# Altium schematic sheet FCT_connector.SchDoc
size A2; DocumentNumber: 5; SheetNumber: 5; SheetTotal: 6
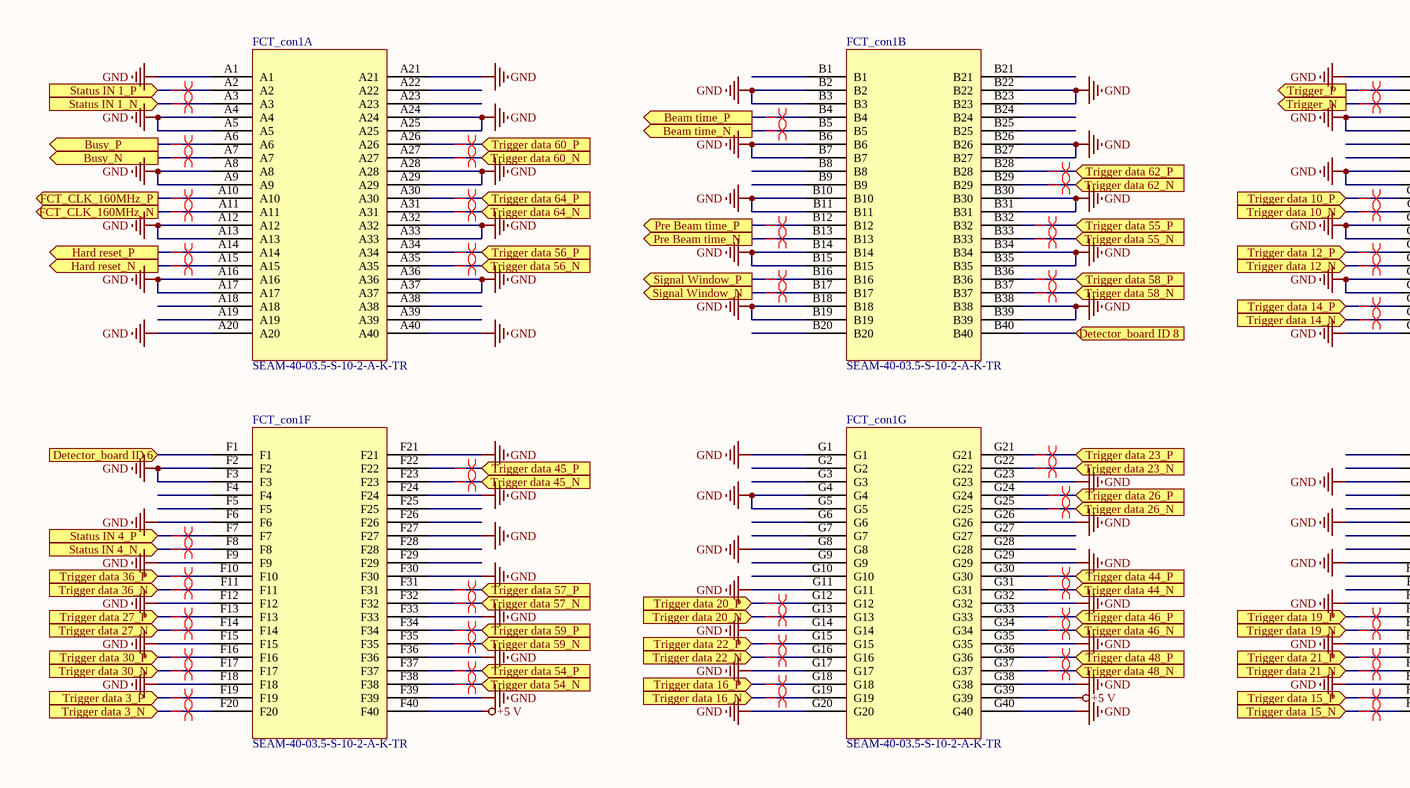
[diagram p0: FCT_connector.SchDoc, left]
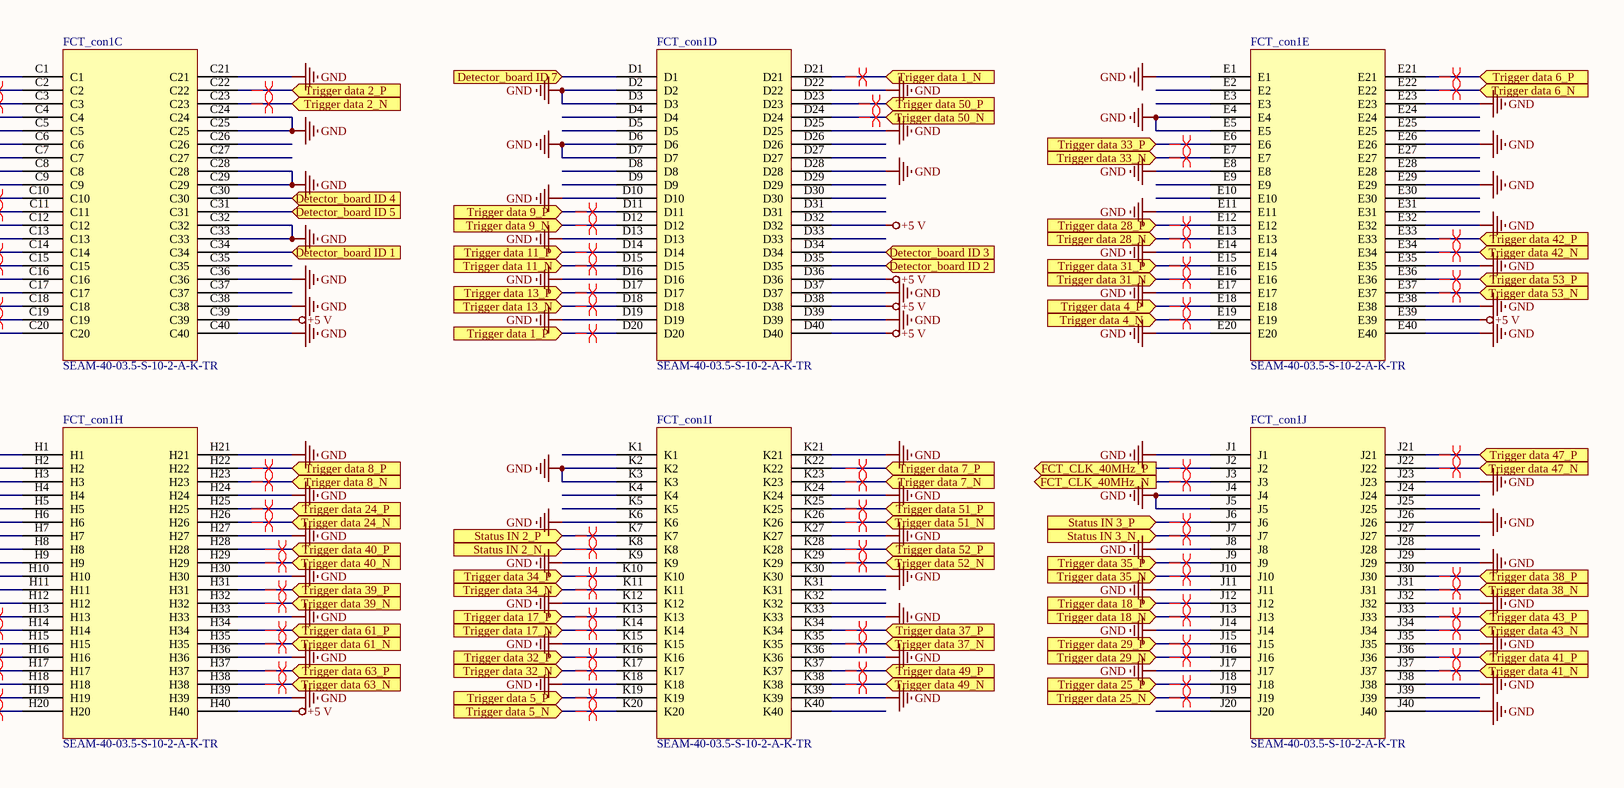
[diagram p1: FCT_connector.SchDoc, right]

## Parts
FCT_con1  SEAM-40-03.5-S-10-2-A-K-TR  [SEAM-40-03.5-S-10-2-A-K-TR]  (parts A,B,C,D,E,F,G,H,I,J of 10)

## Ports
Beam time_N (out), Beam time_P (out), Busy_N (out), Busy_P (out), Detector_board ID 1 (in), Detector_board ID 2 (in), Detector_board ID 3 (in), Detector_board ID 4 (in), Detector_board ID 5 (in), Detector_board ID 6 (in), Detector_board ID 7 (in), Detector_board ID 8 (in), FCT_CLK_40MHz_N (out), FCT_CLK_40MHz_P (out), FCT_CLK_160MHz_N (out), FCT_CLK_160MHz_P (out), Hard reset_N (out), Hard reset_P (out), Pre Beam time_N (out), Pre Beam time_P (out), Signal Window_N (out), Signal Window_P (out), Status IN 1_N (in), Status IN 1_P (in), Status IN 2_N (in), Status IN 2_P (in), Status IN 3_N (in), Status IN 3_P (in), Status IN 4_N (in), Status IN 4_P (in), Trigger data 1_N (in), Trigger data 1_P (in), Trigger data 2_N (in), Trigger data 2_P (in), Trigger data 3_N (in), Trigger data 3_P (in), Trigger data 4_N (in), Trigger data 4_P (in), Trigger data 5_N (in), Trigger data 5_P (in), Trigger data 6_N (in), Trigger data 6_P (in), Trigger data 7_N (in), Trigger data 7_P (in), Trigger data 8_N (in), Trigger data 8_P (in), Trigger data 9_N (in), Trigger data 9_P (in), Trigger data 10_N (in), Trigger data 10_P (in), Trigger data 11_N (in), Trigger data 11_P (in), Trigger data 12_N (in), Trigger data 12_P (in), Trigger data 13_N (in), Trigger data 13_P (in), Trigger data 14_N (in), Trigger data 14_P (in), Trigger data 15_N (in), Trigger data 15_P (in), Trigger data 16_N (in), Trigger data 16_P (in), Trigger data 17_N (in), Trigger data 17_P (in), Trigger data 18_N (in), Trigger data 18_P (in), Trigger data 19_N (in), Trigger data 19_P (in), Trigger data 20_N (in), Trigger data 20_P (in), Trigger data 21_N (in), Trigger data 21_P (in), Trigger data 22_N (in), Trigger data 22_P (in), Trigger data 23_N (in), Trigger data 23_P (in), Trigger data 24_N (in), Trigger data 24_P (in), Trigger data 25_N (in), Trigger data 25_P (in), Trigger data 26_N (in), Trigger data 26_P (in), Trigger data 27_N (in), Trigger data 27_P (in), Trigger data 28_N (in), Trigger data 28_P (in), Trigger data 29_N (in), Trigger data 29_P (in), Trigger data 30_N (in), Trigger data 30_P (in), Trigger data 31_N (in), Trigger data 31_P (in), Trigger data 32_N (in), Trigger data 32_P (in), Trigger data 33_N (in), Trigger data 33_P (in), Trigger data 34_N (in), Trigger data 34_P (in), Trigger data 35_N (in), Trigger data 35_P (in), Trigger data 36_N (in), Trigger data 36_P (in), Trigger data 37_N (in), Trigger data 37_P (in), Trigger data 38_N (in), Trigger data 38_P (in), Trigger data 39_N (in), Trigger data 39_P (in), Trigger data 40_N (in), Trigger data 40_P (in), Trigger data 41_N (in), Trigger data 41_P (in), Trigger data 42_N (in), Trigger data 42_P (in), Trigger data 43_N (in), Trigger data 43_P (in), Trigger data 44_N (in), Trigger data 44_P (in), Trigger data 45_N (in), Trigger data 45_P (in), Trigger data 46_N (in), Trigger data 46_P (in), Trigger data 47_N (in), Trigger data 47_P (in), Trigger data 48_N (in), Trigger data 48_P (in), Trigger data 49_N (in), Trigger data 49_P (in), Trigger data 50_N (in), Trigger data 50_P (in), Trigger data 51_N (in), Trigger data 51_P (in), Trigger data 52_N (in), Trigger data 52_P (in), Trigger data 53_N (in), Trigger data 53_P (in), Trigger data 54_N (in), Trigger data 54_P (in), Trigger data 55_N (in), Trigger data 55_P (in), Trigger data 56_N (in), Trigger data 56_P (in), Trigger data 57_N (in), Trigger data 57_P (in), Trigger data 58_N (in), Trigger data 58_P (in), Trigger data 59_N (in), Trigger data 59_P (in), Trigger data 60_N (in), Trigger data 60_P (in), Trigger data 61_N (in), Trigger data 61_P (in), Trigger data 62_N (in), Trigger data 62_P (in), Trigger data 63_N (in), Trigger data 63_P (in), Trigger data 64_N (in), Trigger data 64_P (in), Trigger_N (out), Trigger_P (out)

## Nets
+5 V: FCT_con1.C39 FCT_con1.D32 FCT_con1.D36 FCT_con1.D38 FCT_con1.D40 FCT_con1.E39 FCT_con1.F40 FCT_con1.G39 FCT_con1.H40
GND: FCT_con1.A1 FCT_con1.A4 FCT_con1.A5 FCT_con1.A8 FCT_con1.A9 FCT_con1.A12 FCT_con1.A13 FCT_con1.A16 FCT_con1.A17 FCT_con1.A20 FCT_con1.A21 FCT_con1.A24 FCT_con1.A25 FCT_con1.A28 FCT_con1.A29 FCT_con1.A32 FCT_con1.A33 FCT_con1.A36 FCT_con1.A37 FCT_con1.A40 FCT_con1.B2 FCT_con1.B3 FCT_con1.B6 FCT_con1.B7 FCT_con1.B10 FCT_con1.B11 FCT_con1.B14 FCT_con1.B15 FCT_con1.B18 FCT_con1.B19 FCT_con1.B22 FCT_con1.B23 FCT_con1.B26 FCT_con1.B27 FCT_con1.B30 FCT_con1.B31 FCT_con1.B34 FCT_con1.B35 FCT_con1.B38 FCT_con1.B39 FCT_con1.C1 FCT_con1.C4 FCT_con1.C5 FCT_con1.C8 FCT_con1.C9 FCT_con1.C12 FCT_con1.C13 FCT_con1.C16 FCT_con1.C17 FCT_con1.C20 FCT_con1.C21 FCT_con1.C24 FCT_con1.C25 FCT_con1.C28 FCT_con1.C29 FCT_con1.C32 FCT_con1.C33 FCT_con1.C36 FCT_con1.C38 FCT_con1.C40 FCT_con1.D2 FCT_con1.D3 FCT_con1.D6 FCT_con1.D7 FCT_con1.D10 FCT_con1.D13 FCT_con1.D16 FCT_con1.D19 FCT_con1.D22 FCT_con1.D25 FCT_con1.D28 FCT_con1.D37 FCT_con1.D39 FCT_con1.E1 FCT_con1.E4 FCT_con1.E5 FCT_con1.E8 FCT_con1.E11 FCT_con1.E14 FCT_con1.E17 FCT_con1.E20 FCT_con1.E23 FCT_con1.E26 FCT_con1.E29 FCT_con1.E32 FCT_con1.E35 FCT_con1.E38 FCT_con1.E40 FCT_con1.F2 FCT_con1.F3 FCT_con1.F6 FCT_con1.F9 FCT_con1.F12 FCT_con1.F15 FCT_con1.F18 FCT_con1.F21 FCT_con1.F24 FCT_con1.F27 FCT_con1.F30 FCT_con1.F33 FCT_con1.F36 FCT_con1.F39 FCT_con1.G1 FCT_con1.G4 FCT_con1.G5 FCT_con1.G8 FCT_con1.G11 FCT_con1.G14 FCT_con1.G17 FCT_con1.G20 FCT_con1.G23 FCT_con1.G26 FCT_con1.G29 FCT_con1.G32 FCT_con1.G35 FCT_con1.G38 FCT_con1.G40 FCT_con1.H3 FCT_con1.H6 FCT_con1.H9 FCT_con1.H12 FCT_con1.H15 FCT_con1.H18 FCT_con1.H21 FCT_con1.H24 FCT_con1.H27 FCT_con1.H30 FCT_con1.H33 FCT_con1.H36 FCT_con1.H39 FCT_con1.J1 FCT_con1.J4 FCT_con1.J5 FCT_con1.J8 FCT_con1.J11 FCT_con1.J14 FCT_con1.J17 FCT_con1.J23 FCT_con1.J26 FCT_con1.J29 FCT_con1.J32 FCT_con1.J35 FCT_con1.J38 FCT_con1.J40 FCT_con1.K2 FCT_con1.K3 FCT_con1.K6 FCT_con1.K9 FCT_con1.K12 FCT_con1.K15 FCT_con1.K18 FCT_con1.K21 FCT_con1.K24 FCT_con1.K27 FCT_con1.K30 FCT_con1.K33 FCT_con1.K36 FCT_con1.K39
Beam time_N: FCT_con1.B5 ; port Beam time_N
Beam time_P: FCT_con1.B4 ; port Beam time_P
Busy_N: FCT_con1.A7 ; port Busy_N
Busy_P: FCT_con1.A6 ; port Busy_P
Detector_board ID 1: FCT_con1.C34 ; port Detector_board ID 1
Detector_board ID 2: FCT_con1.D35 ; port Detector_board ID 2
Detector_board ID 3: FCT_con1.D34 ; port Detector_board ID 3
Detector_board ID 4: FCT_con1.C30 ; port Detector_board ID 4
Detector_board ID 5: FCT_con1.C31 ; port Detector_board ID 5
Detector_board ID 6: FCT_con1.F1 ; port Detector_board ID 6
Detector_board ID 7: FCT_con1.D1 ; port Detector_board ID 7
Detector_board ID 8: FCT_con1.B40 ; port Detector_board ID 8
FCT_CLK_40MHz_N: FCT_con1.J3 ; port FCT_CLK_40MHz_N
FCT_CLK_40MHz_P: FCT_con1.J2 ; port FCT_CLK_40MHz_P
FCT_CLK_160MHz_N: FCT_con1.A11 ; port FCT_CLK_160MHz_N
FCT_CLK_160MHz_P: FCT_con1.A10 ; port FCT_CLK_160MHz_P
Hard reset_N: FCT_con1.A15 ; port Hard reset_N
Hard reset_P: FCT_con1.A14 ; port Hard reset_P
Pre Beam time_N: FCT_con1.B13 ; port Pre Beam time_N
Pre Beam time_P: FCT_con1.B12 ; port Pre Beam time_P
Signal Window_N: FCT_con1.B17 ; port Signal Window_N
Signal Window_P: FCT_con1.B16 ; port Signal Window_P
Status IN 1_N: FCT_con1.A3 ; port Status IN 1_N
Status IN 1_P: FCT_con1.A2 ; port Status IN 1_P
Status IN 2_N: FCT_con1.K8 ; port Status IN 2_N
Status IN 2_P: FCT_con1.K7 ; port Status IN 2_P
Status IN 3_N: FCT_con1.J7 ; port Status IN 3_N
Status IN 3_P: FCT_con1.J6 ; port Status IN 3_P
Status IN 4_N: FCT_con1.F8 ; port Status IN 4_N
Status IN 4_P: FCT_con1.F7 ; port Status IN 4_P
Trigger data 1_N: FCT_con1.D21 ; port Trigger data 1_N
Trigger data 1_P: FCT_con1.D20 ; port Trigger data 1_P
Trigger data 2_N: FCT_con1.C23 ; port Trigger data 2_N
Trigger data 2_P: FCT_con1.C22 ; port Trigger data 2_P
Trigger data 3_N: FCT_con1.F20 ; port Trigger data 3_N
Trigger data 3_P: FCT_con1.F19 ; port Trigger data 3_P
Trigger data 4_N: FCT_con1.E19 ; port Trigger data 4_N
Trigger data 4_P: FCT_con1.E18 ; port Trigger data 4_P
Trigger data 5_N: FCT_con1.K20 ; port Trigger data 5_N
Trigger data 5_P: FCT_con1.K19 ; port Trigger data 5_P
Trigger data 6_N: FCT_con1.E22 ; port Trigger data 6_N
Trigger data 6_P: FCT_con1.E21 ; port Trigger data 6_P
Trigger data 7_N: FCT_con1.K23 ; port Trigger data 7_N
Trigger data 7_P: FCT_con1.K22 ; port Trigger data 7_P
Trigger data 8_N: FCT_con1.H23 ; port Trigger data 8_N
Trigger data 8_P: FCT_con1.H22 ; port Trigger data 8_P
Trigger data 9_N: FCT_con1.D12 ; port Trigger data 9_N
Trigger data 9_P: FCT_con1.D11 ; port Trigger data 9_P
Trigger data 10_N: FCT_con1.C11 ; port Trigger data 10_N
Trigger data 10_P: FCT_con1.C10 ; port Trigger data 10_P
Trigger data 11_N: FCT_con1.D15 ; port Trigger data 11_N
Trigger data 11_P: FCT_con1.D14 ; port Trigger data 11_P
Trigger data 12_N: FCT_con1.C15 ; port Trigger data 12_N
Trigger data 12_P: FCT_con1.C14 ; port Trigger data 12_P
Trigger data 13_N: FCT_con1.D18 ; port Trigger data 13_N
Trigger data 13_P: FCT_con1.D17 ; port Trigger data 13_P
Trigger data 14_N: FCT_con1.C19 ; port Trigger data 14_N
Trigger data 14_P: FCT_con1.C18 ; port Trigger data 14_P
Trigger data 15_N: FCT_con1.H20 ; port Trigger data 15_N
Trigger data 15_P: FCT_con1.H19 ; port Trigger data 15_P
Trigger data 16_N: FCT_con1.G19 ; port Trigger data 16_N
Trigger data 16_P: FCT_con1.G18 ; port Trigger data 16_P
Trigger data 17_N: FCT_con1.K14 ; port Trigger data 17_N
Trigger data 17_P: FCT_con1.K13 ; port Trigger data 17_P
Trigger data 18_N: FCT_con1.J13 ; port Trigger data 18_N
Trigger data 18_P: FCT_con1.J12 ; port Trigger data 18_P
Trigger data 19_N: FCT_con1.H14 ; port Trigger data 19_N
Trigger data 19_P: FCT_con1.H13 ; port Trigger data 19_P
Trigger data 20_N: FCT_con1.G13 ; port Trigger data 20_N
Trigger data 20_P: FCT_con1.G12 ; port Trigger data 20_P
Trigger data 21_N: FCT_con1.H17 ; port Trigger data 21_N
Trigger data 21_P: FCT_con1.H16 ; port Trigger data 21_P
Trigger data 22_N: FCT_con1.G16 ; port Trigger data 22_N
Trigger data 22_P: FCT_con1.G15 ; port Trigger data 22_P
Trigger data 23_N: FCT_con1.G22 ; port Trigger data 23_N
Trigger data 23_P: FCT_con1.G21 ; port Trigger data 23_P
Trigger data 24_N: FCT_con1.H26 ; port Trigger data 24_N
Trigger data 24_P: FCT_con1.H25 ; port Trigger data 24_P
Trigger data 25_N: FCT_con1.J19 ; port Trigger data 25_N
Trigger data 25_P: FCT_con1.J18 ; port Trigger data 25_P
Trigger data 26_N: FCT_con1.G25 ; port Trigger data 26_N
Trigger data 26_P: FCT_con1.G24 ; port Trigger data 26_P
Trigger data 27_N: FCT_con1.F14 ; port Trigger data 27_N
Trigger data 27_P: FCT_con1.F13 ; port Trigger data 27_P
Trigger data 28_N: FCT_con1.E13 ; port Trigger data 28_N
Trigger data 28_P: FCT_con1.E12 ; port Trigger data 28_P
Trigger data 29_N: FCT_con1.J16 ; port Trigger data 29_N
Trigger data 29_P: FCT_con1.J15 ; port Trigger data 29_P
Trigger data 30_N: FCT_con1.F17 ; port Trigger data 30_N
Trigger data 30_P: FCT_con1.F16 ; port Trigger data 30_P
Trigger data 31_N: FCT_con1.E16 ; port Trigger data 31_N
Trigger data 31_P: FCT_con1.E15 ; port Trigger data 31_P
Trigger data 32_N: FCT_con1.K17 ; port Trigger data 32_N
Trigger data 32_P: FCT_con1.K16 ; port Trigger data 32_P
Trigger data 33_N: FCT_con1.E7 ; port Trigger data 33_N
Trigger data 33_P: FCT_con1.E6 ; port Trigger data 33_P
Trigger data 34_N: FCT_con1.K11 ; port Trigger data 34_N
Trigger data 34_P: FCT_con1.K10 ; port Trigger data 34_P
Trigger data 35_N: FCT_con1.J10 ; port Trigger data 35_N
Trigger data 35_P: FCT_con1.J9 ; port Trigger data 35_P
Trigger data 36_N: FCT_con1.F11 ; port Trigger data 36_N
Trigger data 36_P: FCT_con1.F10 ; port Trigger data 36_P
Trigger data 37_N: FCT_con1.K35 ; port Trigger data 37_N
Trigger data 37_P: FCT_con1.K34 ; port Trigger data 37_P
Trigger data 38_N: FCT_con1.J31 ; port Trigger data 38_N
Trigger data 38_P: FCT_con1.J30 ; port Trigger data 38_P
Trigger data 39_N: FCT_con1.H32 ; port Trigger data 39_N
Trigger data 39_P: FCT_con1.H31 ; port Trigger data 39_P
Trigger data 40_N: FCT_con1.H29 ; port Trigger data 40_N
Trigger data 40_P: FCT_con1.H28 ; port Trigger data 40_P
Trigger data 41_N: FCT_con1.J37 ; port Trigger data 41_N
Trigger data 41_P: FCT_con1.J36 ; port Trigger data 41_P
Trigger data 42_N: FCT_con1.E34 ; port Trigger data 42_N
Trigger data 42_P: FCT_con1.E33 ; port Trigger data 42_P
Trigger data 43_N: FCT_con1.J34 ; port Trigger data 43_N
Trigger data 43_P: FCT_con1.J33 ; port Trigger data 43_P
Trigger data 44_N: FCT_con1.G31 ; port Trigger data 44_N
Trigger data 44_P: FCT_con1.G30 ; port Trigger data 44_P
Trigger data 45_N: FCT_con1.F23 ; port Trigger data 45_N
Trigger data 45_P: FCT_con1.F22 ; port Trigger data 45_P
Trigger data 46_N: FCT_con1.G34 ; port Trigger data 46_N
Trigger data 46_P: FCT_con1.G33 ; port Trigger data 46_P
Trigger data 47_N: FCT_con1.J22 ; port Trigger data 47_N
Trigger data 47_P: FCT_con1.J21 ; port Trigger data 47_P
Trigger data 48_N: FCT_con1.G37 ; port Trigger data 48_N
Trigger data 48_P: FCT_con1.G36 ; port Trigger data 48_P
Trigger data 49_N: FCT_con1.K38 ; port Trigger data 49_N
Trigger data 49_P: FCT_con1.K37 ; port Trigger data 49_P
Trigger data 50_N: FCT_con1.D24 ; port Trigger data 50_N
Trigger data 50_P: FCT_con1.D23 ; port Trigger data 50_P
Trigger data 51_N: FCT_con1.K26 ; port Trigger data 51_N
Trigger data 51_P: FCT_con1.K25 ; port Trigger data 51_P
Trigger data 52_N: FCT_con1.K29 ; port Trigger data 52_N
Trigger data 52_P: FCT_con1.K28 ; port Trigger data 52_P
Trigger data 53_N: FCT_con1.E37 ; port Trigger data 53_N
Trigger data 53_P: FCT_con1.E36 ; port Trigger data 53_P
Trigger data 54_N: FCT_con1.F38 ; port Trigger data 54_N
Trigger data 54_P: FCT_con1.F37 ; port Trigger data 54_P
Trigger data 55_N: FCT_con1.B33 ; port Trigger data 55_N
Trigger data 55_P: FCT_con1.B32 ; port Trigger data 55_P
Trigger data 56_N: FCT_con1.A35 ; port Trigger data 56_N
Trigger data 56_P: FCT_con1.A34 ; port Trigger data 56_P
Trigger data 57_N: FCT_con1.F32 ; port Trigger data 57_N
Trigger data 57_P: FCT_con1.F31 ; port Trigger data 57_P
Trigger data 58_N: FCT_con1.B37 ; port Trigger data 58_N
Trigger data 58_P: FCT_con1.B36 ; port Trigger data 58_P
Trigger data 59_N: FCT_con1.F35 ; port Trigger data 59_N
Trigger data 59_P: FCT_con1.F34 ; port Trigger data 59_P
Trigger data 60_N: FCT_con1.A27 ; port Trigger data 60_N
Trigger data 60_P: FCT_con1.A26 ; port Trigger data 60_P
Trigger data 61_N: FCT_con1.H35 ; port Trigger data 61_N
Trigger data 61_P: FCT_con1.H34 ; port Trigger data 61_P
Trigger data 62_N: FCT_con1.B29 ; port Trigger data 62_N
Trigger data 62_P: FCT_con1.B28 ; port Trigger data 62_P
Trigger data 63_N: FCT_con1.H38 ; port Trigger data 63_N
Trigger data 63_P: FCT_con1.H37 ; port Trigger data 63_P
Trigger data 64_N: FCT_con1.A31 ; port Trigger data 64_N
Trigger data 64_P: FCT_con1.A30 ; port Trigger data 64_P
Trigger_N: FCT_con1.C3 ; port Trigger_N
Trigger_P: FCT_con1.C2 ; port Trigger_P

Not connected (* = marked no-connect by the designer): FCT_con1 A18 A19 A22 A23 A38 A39 B1 B8 B9 B20 B21 B24 B25 C6 C7 C26 C27 C35 C37 D4 D5 D8 D9 D26 D27 D29 D30 D31 D33 E2 E3 E9 E10 E24 E25 E27 E28 E30 E31 F4 F5 F25 F26 F28 F29 G2 G3 G6 G7 G9 G10 G27 G28 H1 H2 H4 H5 H7 H8 H10 H11 J20 J24 J25 J27 J28 J39 K1 K4 K5 K31 K32 K40

## Layout directives
differential pair: Beam time_N, Beam time_P, Busy_N, Busy_P, FCT_CLK_40MHz_N, FCT_CLK_40MHz_P, FCT_CLK_160MHz_N, FCT_CLK_160MHz_P, Hard reset_N, Hard reset_P, Pre Beam time_N, Pre Beam time_P, Signal Window_N, Signal Window_P, Status IN 1_N, Status IN 1_P, Status IN 2_N, Status IN 2_P, Status IN 3_N, Status IN 3_P, Status IN 4_N, Status IN 4_P, Trigger data 1_N, Trigger data 1_P, Trigger data 2_N, Trigger data 2_P, Trigger data 3_N, Trigger data 3_P, Trigger data 4_N, Trigger data 4_P, Trigger data 5_N, Trigger data 5_P, Trigger data 6_N, Trigger data 6_P, Trigger data 7_N, Trigger data 7_P, Trigger data 8_N, Trigger data 8_P, Trigger data 9_N, Trigger data 9_P, Trigger data 10_N, Trigger data 10_P, Trigger data 11_N, Trigger data 11_P, Trigger data 12_N, Trigger data 12_P, Trigger data 13_N, Trigger data 13_P, Trigger data 14_N, Trigger data 14_P, Trigger data 15_N, Trigger data 15_P, Trigger data 16_N, Trigger data 16_P, Trigger data 17_N, Trigger data 17_P, Trigger data 18_N, Trigger data 18_P, Trigger data 19_N, Trigger data 19_P, Trigger data 20_N, Trigger data 20_P, Trigger data 21_N, Trigger data 21_P, Trigger data 22_N, Trigger data 22_P, Trigger data 23_N, Trigger data 23_P, Trigger data 24_N, Trigger data 24_P, Trigger data 25_N, Trigger data 25_P, Trigger data 26_N, Trigger data 26_P, Trigger data 27_N, Trigger data 27_P, Trigger data 28_N, Trigger data 28_P, Trigger data 29_N, Trigger data 29_P, Trigger data 30_N, Trigger data 30_P, Trigger data 31_N, Trigger data 31_P, Trigger data 32_N, Trigger data 32_P, Trigger data 33_N, Trigger data 33_P, Trigger data 34_N, Trigger data 34_P, Trigger data 35_N, Trigger data 35_P, Trigger data 36_N, Trigger data 36_P, Trigger data 37_N, Trigger data 37_P, Trigger data 38_N, Trigger data 38_P, Trigger data 39_N, Trigger data 39_P, Trigger data 40_N, Trigger data 40_P, Trigger data 41_N, Trigger data 41_P, Trigger data 42_N, Trigger data 42_P, Trigger data 43_N, Trigger data 43_P, Trigger data 44_N, Trigger data 44_P, Trigger data 45_N, Trigger data 45_P, Trigger data 46_N, Trigger data 46_P, Trigger data 47_N, Trigger data 47_P, Trigger data 48_N, Trigger data 48_P, Trigger data 49_N, Trigger data 49_P, Trigger data 50_N, Trigger data 50_P, Trigger data 51_N, Trigger data 51_P, Trigger data 52_N, Trigger data 52_P, Trigger data 53_N, Trigger data 53_P, Trigger data 54_N, Trigger data 54_P, Trigger data 55_N, Trigger data 55_P, Trigger data 56_N, Trigger data 56_P, Trigger data 57_N, Trigger data 57_P, Trigger data 58_N, Trigger data 58_P, Trigger data 59_N, Trigger data 59_P, Trigger data 60_N, Trigger data 60_P, Trigger data 61_N, Trigger data 61_P, Trigger data 62_N, Trigger data 62_P, Trigger data 63_N, Trigger data 63_P, Trigger data 64_N, Trigger data 64_P, Trigger_N, Trigger_P